# Altium schematic sheet plsoxmeter.SchDoc: Pulse oximeter
size A4; Revision: 1; SheetNumber: 8; SheetTotal: 9
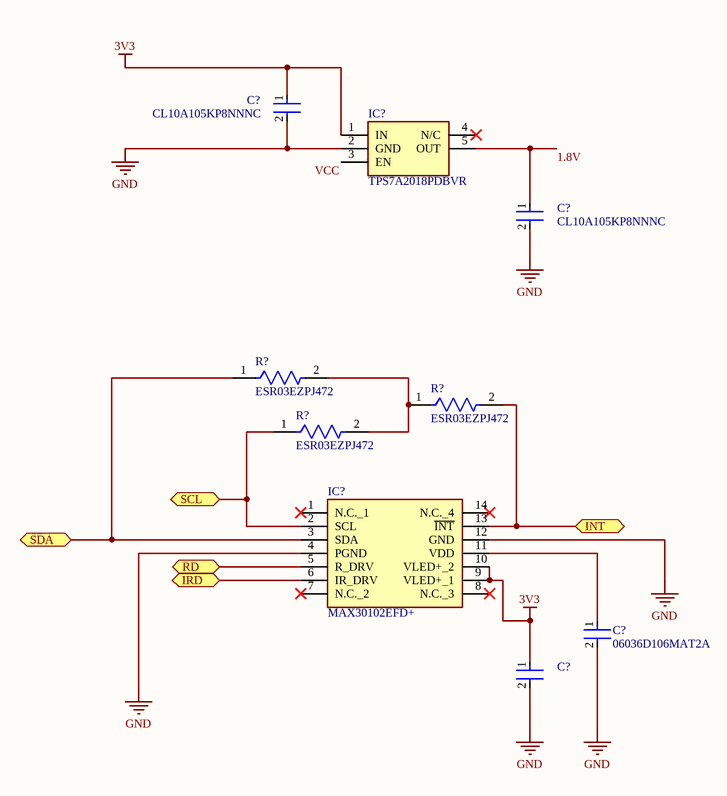
[diagram p0: plsoxmeter.SchDoc]

## Parts
(Parts that share a designator on the sheet are numbered #1, #2 ... from top to bottom, then left to right.)
C?#1  CL10A105KP8NNNC  [FP-CL10-IPC_C]
C?#2  CL10A105KP8NNNC  [FP-CL10-IPC_C]
C?#3  06036D106MAT2A  [FP-0603-L_1_6_0_15-W_0_81-IPC_B]
C?#4  CL10A105KP8NNNC  [FP-CL10-IPC_C]  (value not drawn)
IC?#1  TPS7A2018PDBVR  [SOT95P280X145-5N]
IC?#2  MAX30102EFD+  [14-LEAD-OESIP]
R?#1  ESR03EZPJ472  [FP-ESR03-IPC_A]
R?#2  ESR03EZPJ472  [FP-ESR03-IPC_A]
R?#3  ESR03EZPJ472  [FP-ESR03-IPC_A]

## Ports
INT (bidir), IRD (bidir), RD (bidir), SCL (bidir), SDA (bidir)

## Nets
3V3: C?#1.1 C?#4.1 IC?#1.1(IN) IC?#2.9(VLED+_1) IC?#2.10(VLED+_2)
GND: C?#1.2 C?#2.2 C?#3.2 C?#4.2 IC?#1.2(GND) IC?#2.4(PGND) IC?#2.12(GND)
1.8V: C?#2.1 IC?#1.5(OUT)
INT: IC?#2.13(~{INT}) R?#2.2 ; port INT
IRD: IC?#2.6(IR_DRV) ; port IRD
RD: IC?#2.5(R_DRV) ; port RD
SCL: IC?#2.2(SCL) R?#3.1 ; port SCL
SDA: IC?#2.3(SDA) R?#1.1 ; port SDA
VCC: IC?#1.3(EN)
NetC?#3_1: C?#3.1 IC?#2.11(VDD)
NetR?#1_2: R?#1.2 R?#2.1 R?#3.2

Not connected (* = marked no-connect by the designer): IC?#1 4(N/C)*; IC?#2 1(N.C._1)* 7(N.C._2)* 8(N.C._3)* 14(N.C._4)*

## Notes on the sheet
- Title:
- Size:
- Document Number :
- Revision
- Drawn by:
- Checked by:
- Date:
- A4
- Time:
- Aprooved by:
- Sheet:
- of
- File:
- URL:

## Library data of the parts
C?#1 C?#2 C?#4 = CMP-13271-003399-1: Cap Ceramic 1uF 10V X5R ±10% Pad SMD 0603 +85°C T/R; Min Operating Temperature: -55°C; Max Operating Temperature: 85°C; Dielectric: X5R; Contact Plating: Tin; Height: 0.8mm; Voltage: 10V; Packaging: Tape and Reel; Voltage Rating: 10V; Capacitance: 1uF; Package Quantity: 1; Width: 0.031inch; Length: 1.6mm; Depth: 0.8mm; Case/Package: 0603; Case Code (Imperial): 0603; Thickness: 0.035inch; Radiation Hardening: No; Tolerance: 10%; Case Code (Metric): 1608; Mount: Surface Mount
C?#3 = CMP-2006-04476-2: General Purpose Ceramic Capacitor, 0603, 10uF, 20%, X5R, 15%, 6.3V; RoHS Compliant: Yes; Case Code (Imperial): 0603; Construction: Flat; Thickness: 0.035inch; Height: 0.9mm; Number of Pins: 2; Max Operating Temperature: 85°C; Capacitance: 10uF; Length: 1.6mm; REACH SVHC: No SVHC; Width: 0.032inch; Voltage Rating (DC): 6.3V; Termination: SMD/SMT; Contact Plating: Tin; Min Operating Temperature: -55°C; Depth: 0.81mm; Packaging: Tape and Reel; Case Code (Metric): 1608; Voltage Rating: 6.3V; Lead Free: Lead Free; Mount: Surface Mount; Radiation Hardening: No; Series: -; Dielectric Material: Ceramic; Package Quantity: 1; Case/Package: 0603; Tolerance: 20%; Dielectric: X5R; Voltage: 6.3V
IC?#1 = TPS7A2018PDBVR: Integrated Circuit; Manufacturer_Name: Texas Instruments; Datasheet Link: https://datasheet.datasheetarchive.com/originals/distributors/Datasheets_SAMA/e65d9d311cedf91014769949f3101225.pdf; Height: 1.45mm; Manufacturer_Part_Number: TPS7A2018PDBVR; Mouser Part Number: 595-TPS7A2018PDBVR; Mouser Price/Stock: https://www.mouser.co.uk/ProductDetail/Texas-Instruments/TPS7A2018PDBVR?qs=hd1VzrDQEGheW9qdrIVGew%3D%3D; Arrow Part Number: TPS7A2018PDBVR; Arrow Price/Stock: https://www.arrow.com/en/products/tps7a2018pdbvr/texas-instruments?region=nac
IC?#2 = MAX30102EFD+: Integrated Circuit; Manufacturer_Name: Analog Devices; Datasheet Link: https://datasheets.maximintegrated.com/en/ds/MAX30102.pdf; Manufacturer_Part_Number: MAX30102EFD+; Mouser Part Number: 700-MAX30102EFD+; Mouser Price/Stock: https://www.mouser.co.uk/ProductDetail/Analog-Devices-Maxim-Integrated/MAX30102EFD%2b?qs=nVS1qgv%252BQrk9UYEvS27V%2Fg%3D%3D
R?#1-R?#3 = CMP-08839-007853-1: 4.7kΩ ±5% 0.25W 0603 Anti-Surge Chip Resistor AEC-Q200; Max Power Dissipation: 250mW; Resistance: 4.7kR; Temperature Coefficient: 200ppm/°C; Packaging: Tape and Reel; Series: ESR; Height: 0.022inch; Case Code (Imperial): 0603; Tolerance: 5%; RoHS Compliant: Yes; Case/Package: 0603; Min Operating Temperature: -55°C; Resistor Type: Thick Film; Package Quantity: 5000; Features: Automotive AEC-Q200; Width: 0.031inch; Length: 0.063inch; Max Operating Temperature: 155°C; Number of Terminations: 2